# EasyEDA schematic schematics.json
TITLE: TinyML Maze Shield; REV: 1.0; Date: 2026-05-12; Sheet: 1/1; Drawn By: Silas Löffler; Company: HS Ansbach
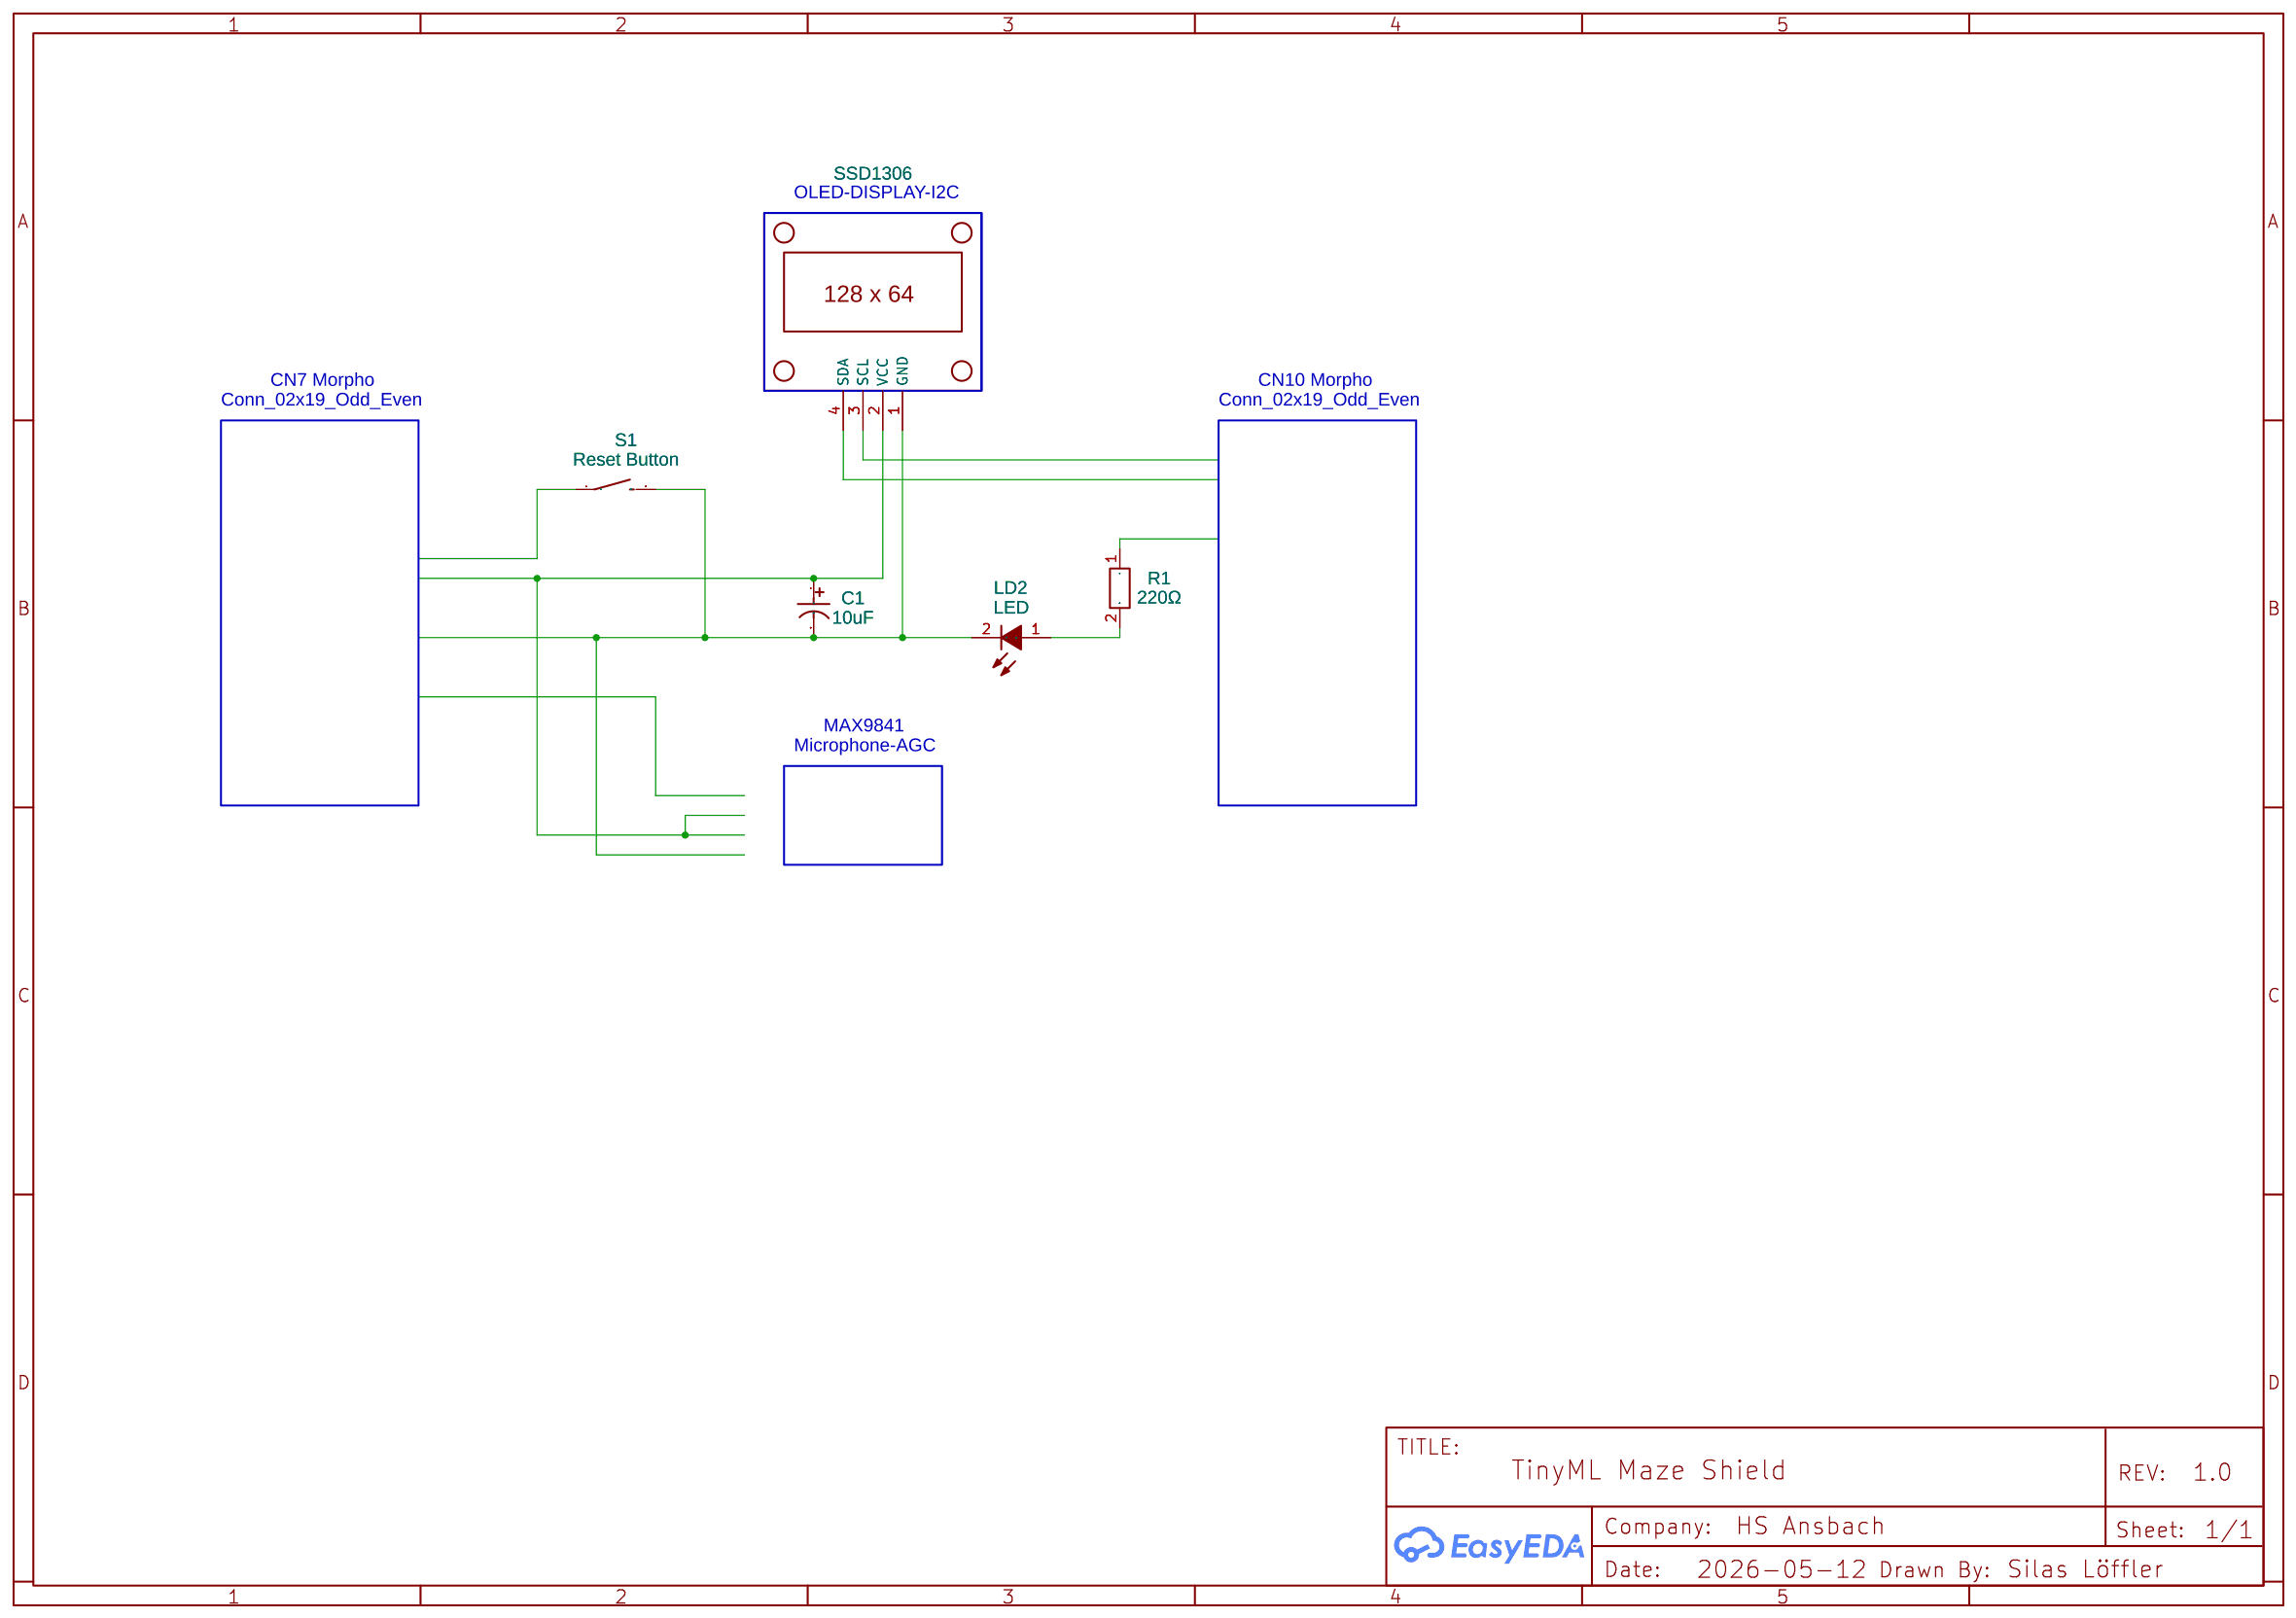
[diagram p0: schematic sheet]

## Parts
C1  10uF  [CAPACITOR 10UF 50V]
LCD1  SSD1306  [SSD1306-OLED-128X64-I2C-NOHOLES]
LD2  LED  [LED-TH_LED-DP2-2LED-AMCC]
R1  220Ω  [220Ω-RESISTOR]
S1  Reset Button  [SPARKFUN-SWITCHES_TACTILE_SWITCH_PTH_6.0MM]

## Library data of the parts
C1 = ELCO 10UF 50V _DEXTER: Supplier: LCSC; Manufacturer: ValuePro; Manufacturer Part: electrolytic capacitor10UF50V; Supplier Part: C32856; Contributor: maftukin
LCD1 = SSD1306-OLED-128X64-I2C-NOHOLES: Contributor: BGWorks
LD2 = LED: Supplier: Digi-Key; Manufacturer: VccLite; Manufacturer Part: 5600; Supplier Part: L20325-ND; link: https://vcclite.com/product/5602f5-5v/; Contributor: mt24cmn006; Package Display: No
R1 = 220Ω-RESISTOR: Contributor: frengkihotsabarsimatupang1
S1 = SWITCH: Contributor: palaitot123; Manufacturer Part: X; Supplier: ITCH; Supplier Part: X; Manufacturer: X; link: X

## Nets
Net-(C1-1): C1.1 LCD1.2(VCC)
Net-(C1-2): C1.2 LCD1.1(GND) LD2.2(K) S1.2
Net-(LD2-1): LD2.1(A) R1.2

Not connected (* = marked no-connect by the designer): LCD1 3(SCL) 4(SDA); R1 1; S1 1

## Notes on the sheet
- OLED-DISPLAY-I2C
- Conn_02x19_Odd_Even
- CN7 Morpho
- Conn_02x19_Odd_Even
- CN10 Morpho
- MAX9841
- Microphone-AGC
